# EAGLE design nshift (EAGLE 8.2.2)
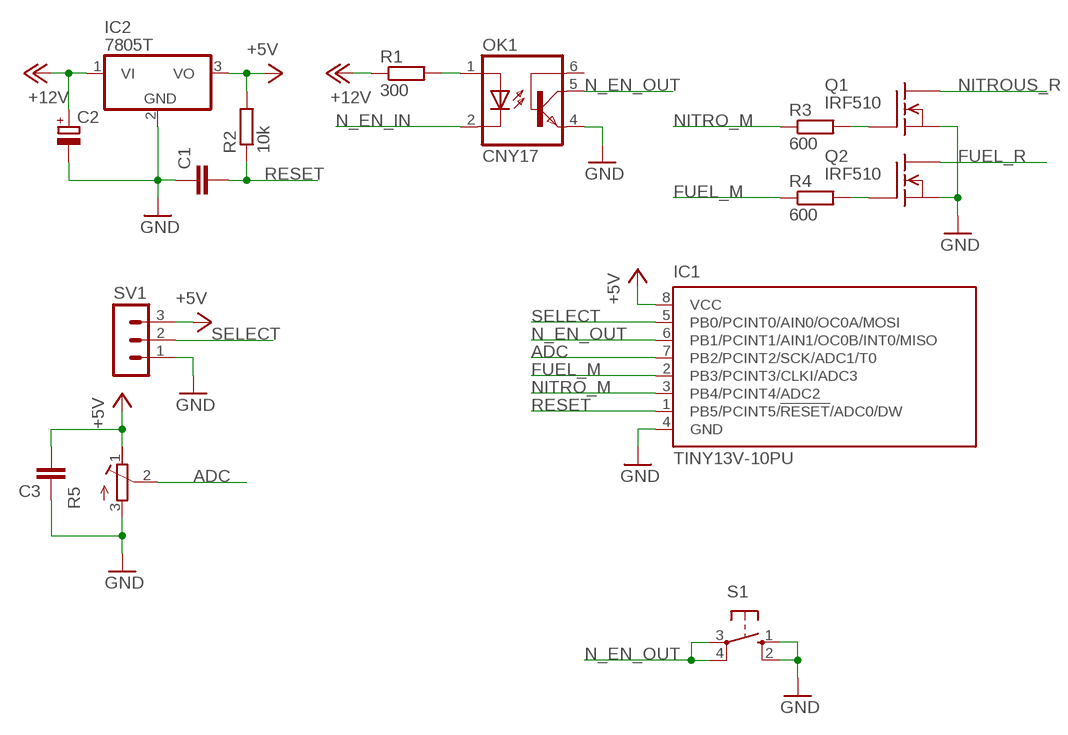
[diagram p0: schematic, sheet 1]

## Parts
C1  C-EUC1206  [C1206]
C2  CPOL-EUE2.5-7  [E2,5-7]
C3  C-EUC1206  [C1206]
IC1  TINY13V-10PU  [DIL08]
IC2  7805T  [TO220H]
OK1  CNY17  [DIL06]
Q1  IRF510  [TO220]
Q2  IRF510  [TO220]
R1  300  R-EU_R1206  [R1206]
R2  10k  R-EU_0207/10  [0207/10]
R3  600  R-EU_0207/7  [0207/7]
R4  600  R-EU_0207/7  [0207/7]
R5  R-TRIMMT93XB  [RTRIMT93XB]
S1  10-XX  [B3F-10XX]
SV1  MA03-1  [MA03-1]

## Nets
+5V: C3.2 IC1.8(VCC) IC2.3(VO) R2.2 R5.1(A) SV1.3
+12V: C2.+ IC2.1(VI) R1.1
ADC: IC1.7(PB2/PCINT2/SCK/ADC1/T0) R5.2(S)
FUEL_M: IC1.2(PB3/PCINT3/CLKI/ADC3) R4.1
FUEL_R: Q2.2(D)
GND: C1.1 C2.- C3.1 IC1.4(GND) IC2.2(GND) OK1.4(EMI) Q1.3(S) Q2.3(S) R5.3(E) S1.1(S) S1.2(S1) SV1.1
N$1: OK1.1(A) R1.2
N$2: Q2.1(G) R4.2
N$3: Q1.1(G) R3.2
N_EN_IN: OK1.2(C)
N_EN_OUT: IC1.6(PB1/PCINT1/AIN1/OC0B/INT0/MISO) OK1.5(COL) S1.3(P) S1.4(P1)
NITRO_M: IC1.3(PB4/PCINT4/ADC2) R3.1
NITROUS_R: Q1.2(D)
RESET: C1.2 IC1.1(PB5/PCINT5/!RESET!/ADC0/DW) R2.1
SELECT: IC1.5(PB0/PCINT0/AIN0/OC0A/MOSI) SV1.2
Unconnected: OK1.6(BAS)

## Library data of the parts
C1 C3 = resistor:C-EU: CAPACITOR, European symbol
C2 = resistor:CPOL-EU: POLARIZED CAPACITOR, European symbol
IC1 = atmel:TINY13: 8-bit AVR Microcontroller with 1K Bytes In-System Programmable Flash Source: http://www.atmel.com/dyn/resources/prod_documents/2535S.pdf; MPN: ATTINY13V-10PU; OC_FARNELL: 9171576; OC_NEWARK: 96K6523
IC2 = linear:78*: Positive VOLTAGE REGULATOR Source: http://cache.national.com/ds/LM/LM78L05.pdf http://www.fairchildsemi.com/ds/LM/LM7805.pdf
OK1 = optocoupler:CNY17: SIEMENS OPTO COUPLER; MPN: CNY17-1; OC_FARNELL: 1045399; OC_NEWARK: 05M4044
Q1 Q2 = transistor-fet:IRF510: N-Channel Enhancement MOSFET (HEXFET); 100V; 5,6A; 0,54Ohm
R1-R4 = resistor:R-EU_: RESISTOR, European symbol
R5 = resistor:R-TRIMM: Trimm resistor
S1 = switch-omron:10-XX: OMRON SWITCH; MPN: B3F-1000; OC_FARNELL: 176432; OC_NEWARK: 36M3542
SV1 = con-lstb:MA03-1: PIN HEADER; OC_FARNELL: unknown; OC_NEWARK: unknown

## Board
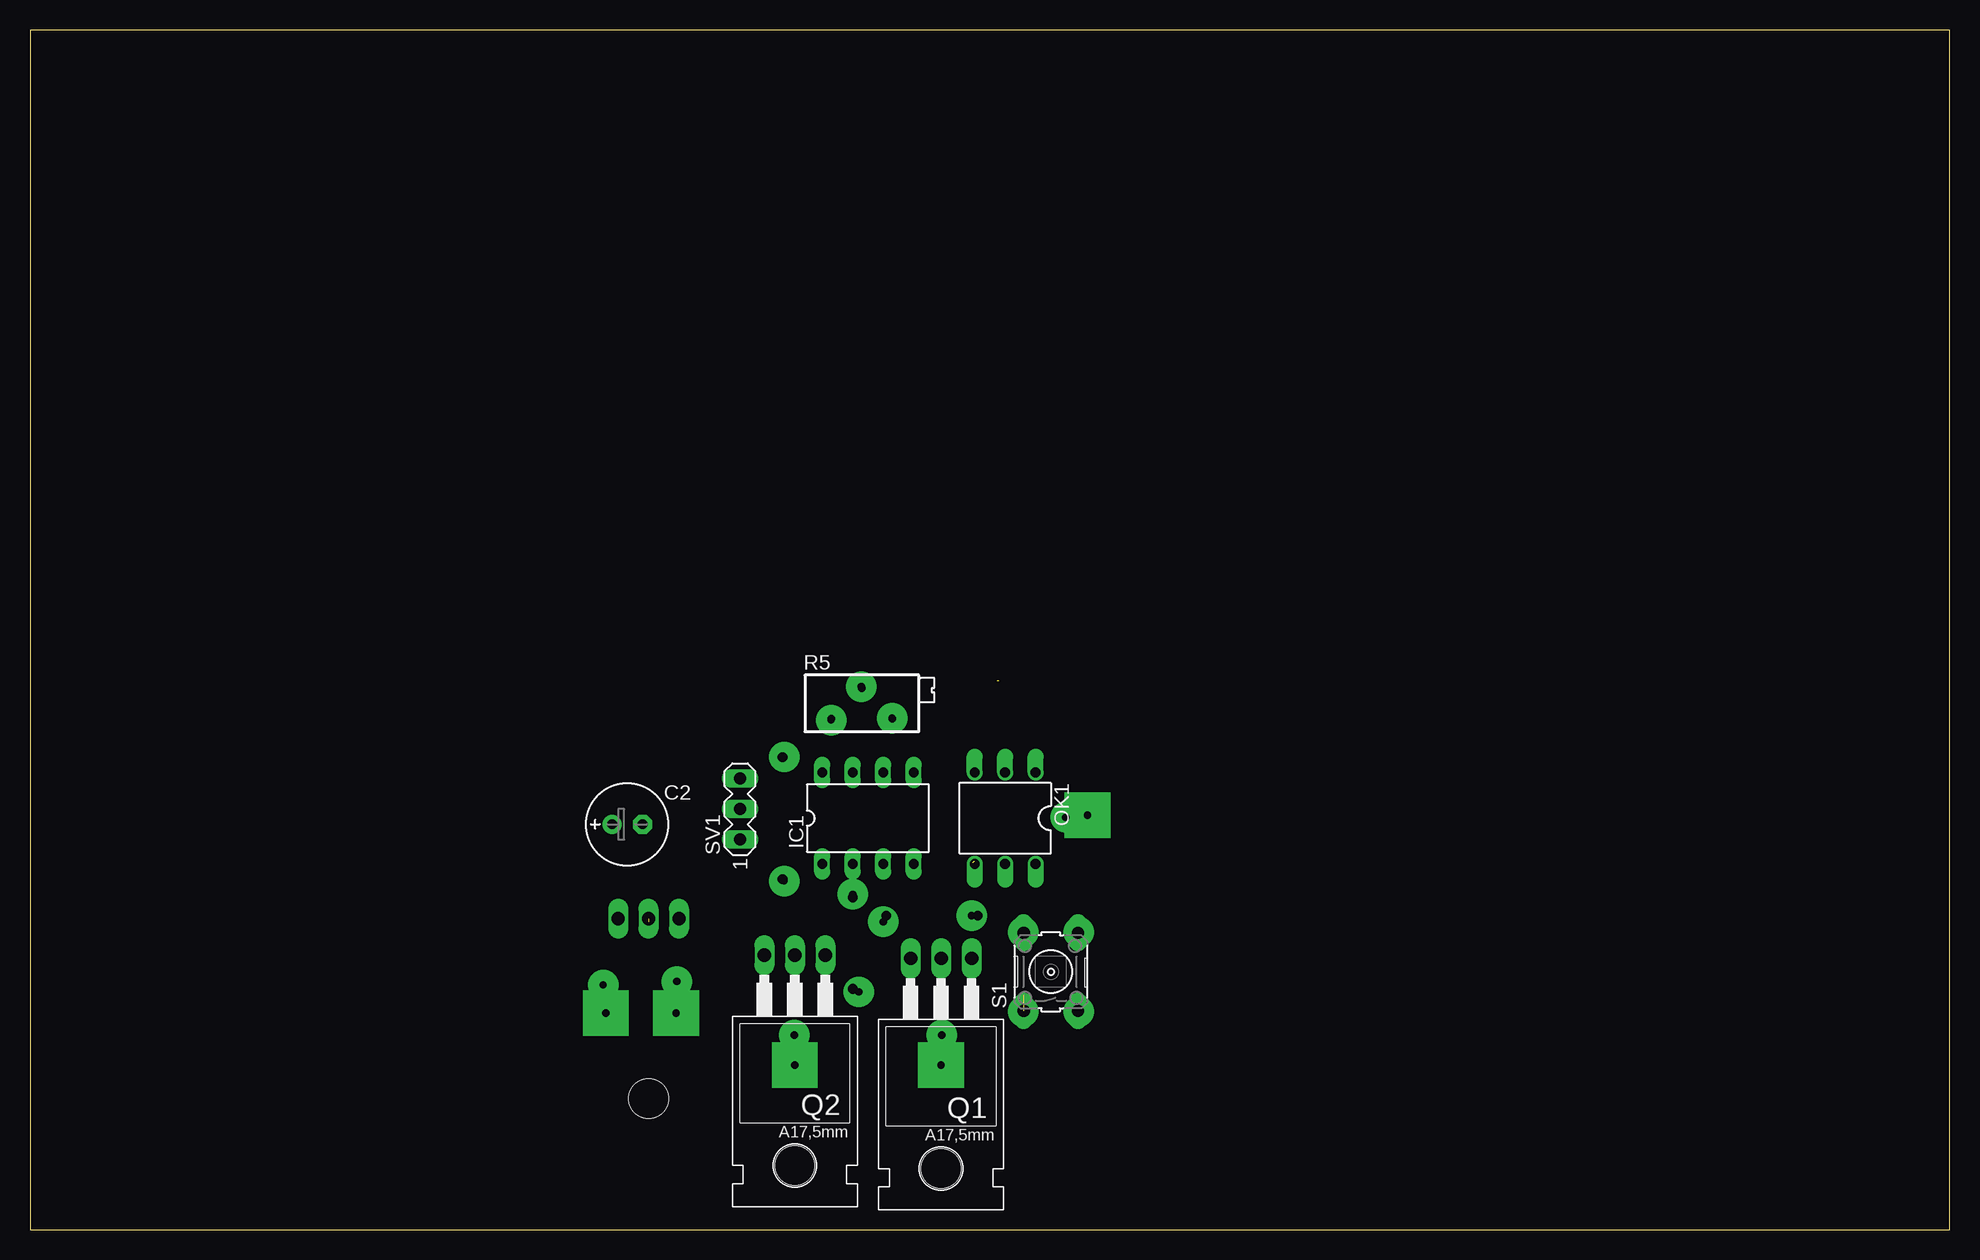
[diagram p1: board, top side]
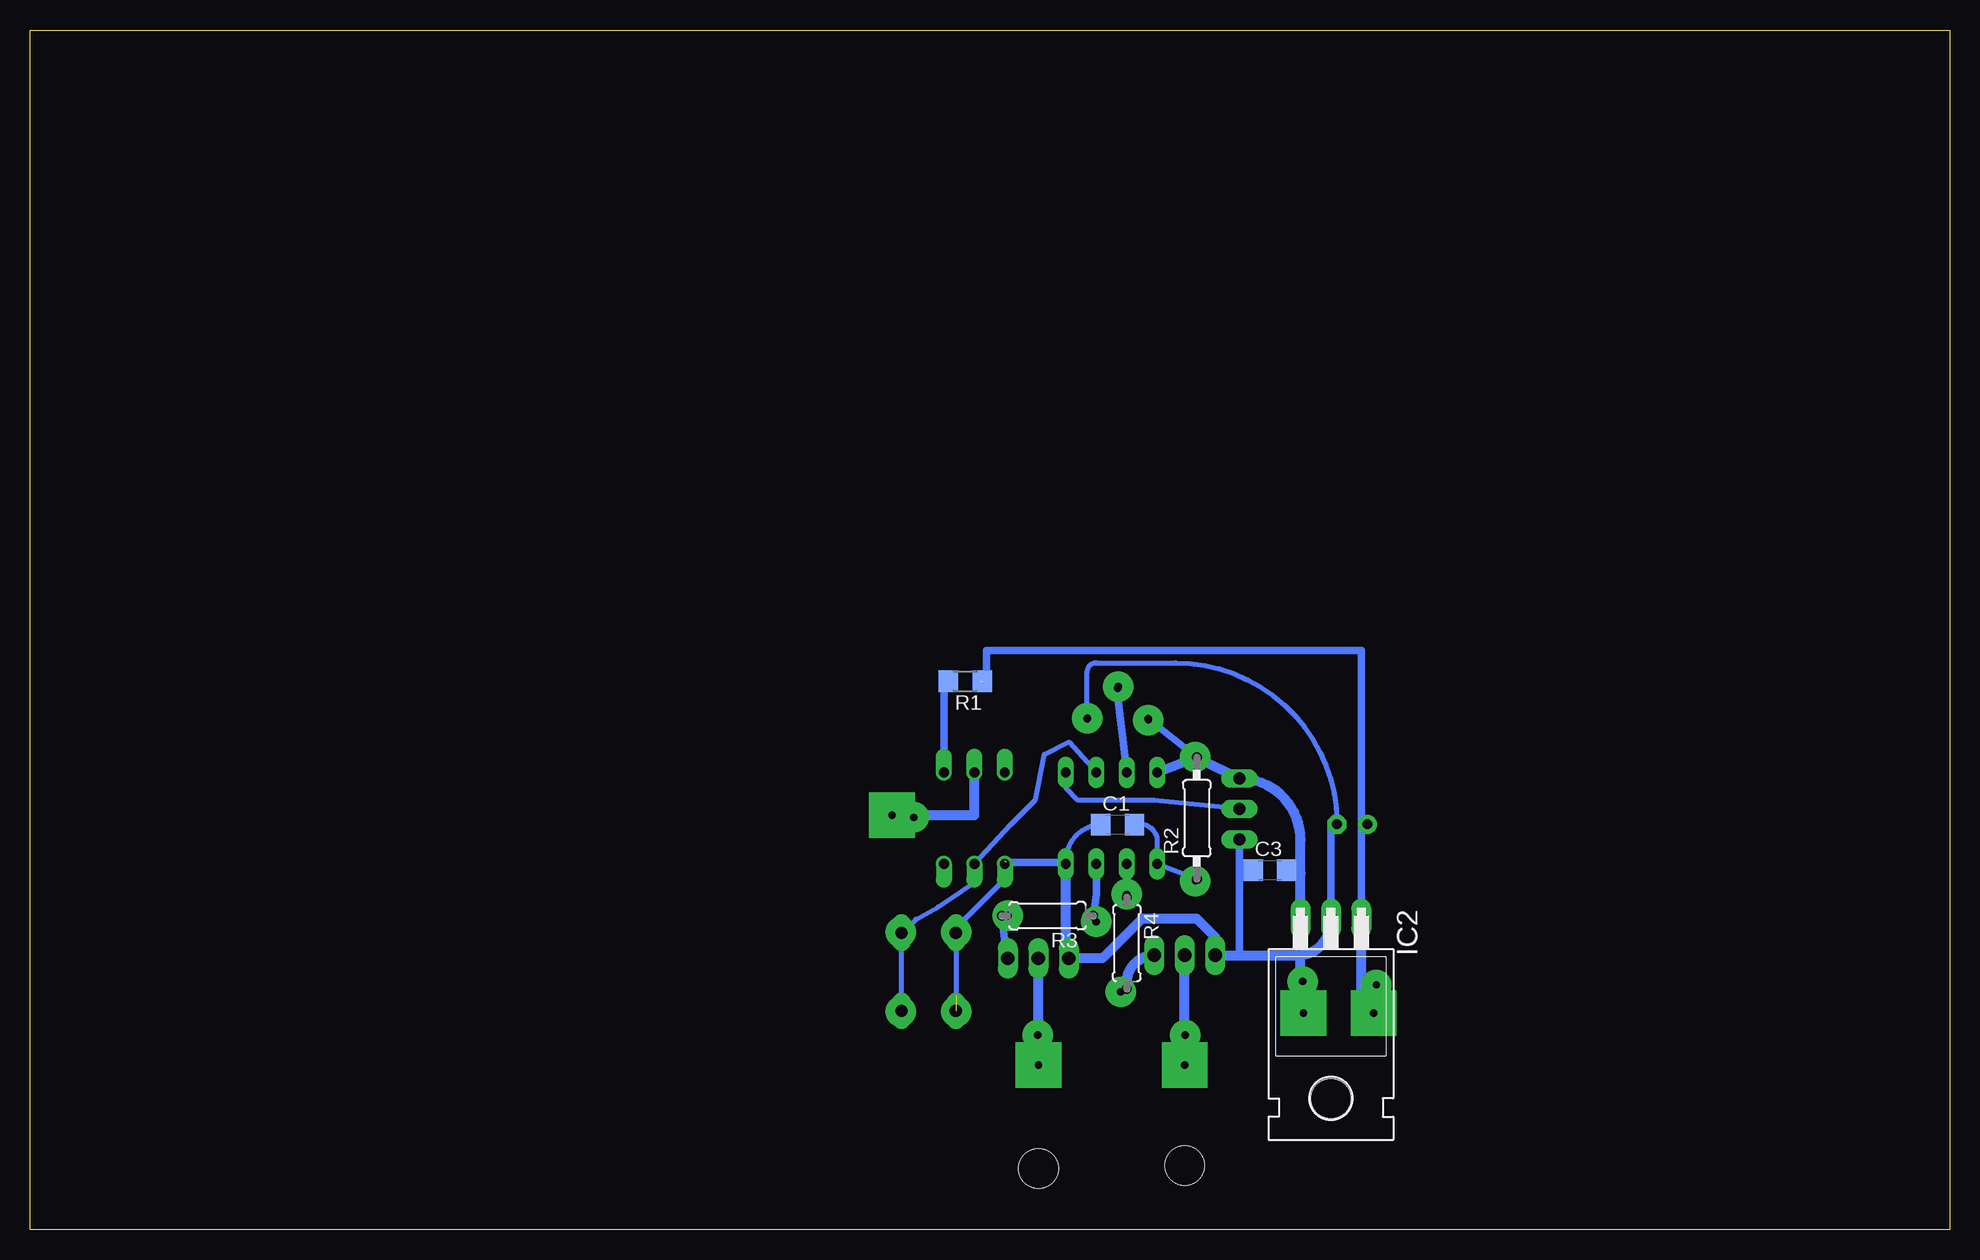
[diagram p2: board, bottom side, seen from below]

Size 160 x 100 mm. Coordinates in mm from the lower left corner, seen from the top.
Outline: 0,0 160,0 160,100 0,100 0,0
Copper layers (1*16): Top 0.035mm / dielectric 1.5mm / Bottom 0.035mm
Design rules: minimum track width 10mil, minimum drill 50mil, track to track 8mil, track to pad 8mil, pad to pad 8mil, via to via 8mil, smd to smd 8mil, copper to edge 40mil, drill to drill 8mil, minimum pad ring 10mil, minimum via ring 8mil, stop-mask expansion 4mil, vias tented up to drill 0mil, thermal gap 10mil

### Footprints (pad centres in the part's own frame; a part is rotated, then mirrored left to right if it is on the bottom)
C1206 = smd 1.6 x 1.8: 1 -1.4,0; 2 1.4,0
E2,5-7 = drill 0.813 pad 1.6: + -1.27,0 | drill 0.813 pad 1.6 octagon: - 1.27,0
DIL08 = drill 0.813 long: 1 -3.81,-3.81; 2 -1.27,-3.81; 3 1.27,-3.81; 4 3.81,-3.81; 5 3.81,3.81; 6 1.27,3.81; 7 -1.27,3.81; 8 -3.81,3.81
TO220H = drill 1.118 long: 1 -2.54,-10.16; 2 0,-10.16; 3 2.54,-10.16 | hole 3.302: 0,4.826
DIL06 = drill 0.813 offset: 1 -2.54,-3.81; 2 0,-3.81; 3 2.54,-3.81; 4 2.54,3.81; 5 0,3.81; 6 -2.54,3.81
TO220 = drill 1.118 long: 1 -2.54,-6.35; 2 0,-6.35; 3 2.54,-6.35 | hole 3.302: 0,11.176
R1206 = smd 1.6 x 1.803: 1 -1.422,0; 2 1.422,0
0207/10 = drill 0.813 octagon: 1 -5.08,0; 2 5.08,0
0207/7 = drill 0.813 octagon: 1 -3.81,0; 2 3.81,0
RTRIMT93XB = drill 0.61: 1 1.27,-2.54; 2 -1.27,0; 3 1.27,2.54
B3F-10XX = drill 1.016 long: 1 -3.251,2.261; 2 3.251,2.261; 3 -3.251,-2.261; 4 3.251,-2.261
MA03-1 = drill 1.016 long: 1 -2.54,0; 2 0,0; 3 2.54,0

### Placement (x,y rotation side)
C1  69.34,33.76 0 bottom
C2  49.78,33.78 0 top
C3  56.64,29.97 0 bottom
IC1  69.85,34.29 0 top
IC2  51.56,15.75 180 bottom
OK1  81.28,34.29 180 top
Q1  75.95,16.26 180 top
Q2  63.75,16.51 180 top
R1  82.04,45.72 180 bottom
R2  62.74,34.29 90 bottom
R3  75.18,26.16 180 bottom
R4  68.58,23.88 270 bottom
R5  69.34,43.87 270 top
S1  85.09,21.49 90 top
SV1  59.18,35.05 90 top

### Tracks (layer width: path | path; a pad name or v marks a point on that pad's centre or on a via)
+5V
  Bottom 0.61: R5.1 R2.2 | C3.2 54.36,29.97 arc90 54.1,29.72
  Bottom 0.813: IC1.8 R2.2 SV1.3 arc90 54.1,32.51 54.1,29.72 IC2.3
+12V  (1 unrouted)
  Bottom 0.61: IC2.1 49.02,33.78 | 49.02,33.78 49.02,48.26 80.26,48.26 80.26,45.72 | 80.26,45.72 80.26,45.47 80.77,45.47 80.77,45.72 80.26,45.72 | C2.+ 49.02,33.78
  Bottom 0.813: 48.01,17.78 49.02,17.78 IC2.1
ADC
  Bottom 0.61: R5.2 69.42,45.21 IC1.7
FUEL_M  (via drill 0.6 pad 2.54)
  Bottom 0.61: R4.1 v68.58,27.94 IC1.2
FUEL_R
  Bottom 0.813: 63.5,13.46 63.75,13.46 Q2.2
GND  (via drill 0.6 pad 2.54)  (3 unrouted)
  Bottom 0.406: C1.1 arc-90 73.66,30.61 IC1.4 | R5.3 71.88,46.48 arc90 71.12,47.24 64.52,47.24 arc90 C2.- | 78.74,30.73 78.74,29.21 82.09,25.86 S1.2 82.83,19.33 v82.8,18.19 82.8,19.56
  Bottom 0.61: 73.66,30.61 78.61,30.61 OK1.4 | IC2.2 51.56,33.53 51.05,33.53 C2.- | SV1.1 59.18,29.97 | 59.18,29.97 59.18,22.86 | C3.1 59.18,29.97
  Bottom 0.813: IC1.4 73.66,22.86 Q1.3 70.61,22.61 67.31,25.91 62.74,25.91 61.21,24.38 Q2.3 59.18,22.86 54.36,22.86 arc-90 51.56,25.65
N$1
  Bottom 0.61: OK1.1 83.82,45.72 R1.2
N$2
  Bottom 0.813: R4.2 68.58,20.57 arc90 Q2.1
N$3
  Bottom 0.61: R3.2 78.89,25.25 78.74,23.88 Q1.1
N$4  (via drill 0.6 pad 3.81)
  other vias: 48.01,18.03
N$5  (via drill 0.6 pad 3.81)
  other vias: 53.85,18.03
N$6  (via drill 0.6 pad 3.81)
  other vias: 63.75,13.72
N$7  (via drill 0.6 pad 3.81)
  other vias: 75.95,13.72
N$8  (via drill 0.6 pad 3.81)
  Bottom 0.813: v88.14,34.54 81.28,34.54 81.28,38.35
N$9
  Bottom 0.813: 53.85,17.78 54.1,17.78 54.1,22.86
N$10  (via drill 0.6 pad 2.54)
  other vias: 71.12,25.65
N$11  (via drill 0.6 pad 2.54)
  other vias: 78.49,26.16
N$12  (via drill 0.6 pad 2.54)
  other vias: 69.09,19.81
N$13  (via drill 0.6 pad 2.54)
  other vias: 71.86,42.62
N$14  (via drill 0.6 pad 2.54)
  other vias: 87.4,24.79
N$15  (via drill 0.6 pad 2.54)
  other vias: 87.4,18.19
N$16  (via drill 0.6 pad 2.54)
  other vias: 82.8,24.79
N$17  (via drill 0.6 pad 2.54)
  other vias: 62.87,29.06
N$18  (via drill 0.6 pad 2.54)
  other vias: 62.87,39.4
N$19  (via drill 0.6 pad 2.54)
  other vias: 66.78,42.47
N$20  (via drill 0.6 pad 2.54)
  other vias: 69.29,45.26
N$21  (via drill 0.6 pad 2.54)
  other vias: 47.78,20.4
N$22  (via drill 0.6 pad 2.54)
  other vias: 53.92,20.68
N$23  (via drill 0.6 pad 2.54)
  other vias: 63.7,16.21
N$24  (via drill 0.6 pad 2.54)
  other vias: 76,16.21
N$25  (via drill 0.6 pad 2.54)
  other vias: 86.33,34.37
N_EN_OUT
  Bottom 0.406: IC1.6 73.41,40.64 75.44,39.62 76.2,35.81 78.23,33.78 OK1.5 81.28,28.96 84.28,26.9 86.16,25.86 S1.4 S1.3
NITRO_M
  Bottom 0.61: R3.1 71.12,27.94 IC1.3
NITROUS_R
  Bottom 0.813: 75.95,13.46 Q1.2
RESET
  Bottom 0.406: C1.2 arc90 66.04,32.64 IC1.1 R2.1
SELECT
  Bottom 0.406: SV1.2 66.29,35.79 72.64,35.79 73.66,36.83 IC1.5